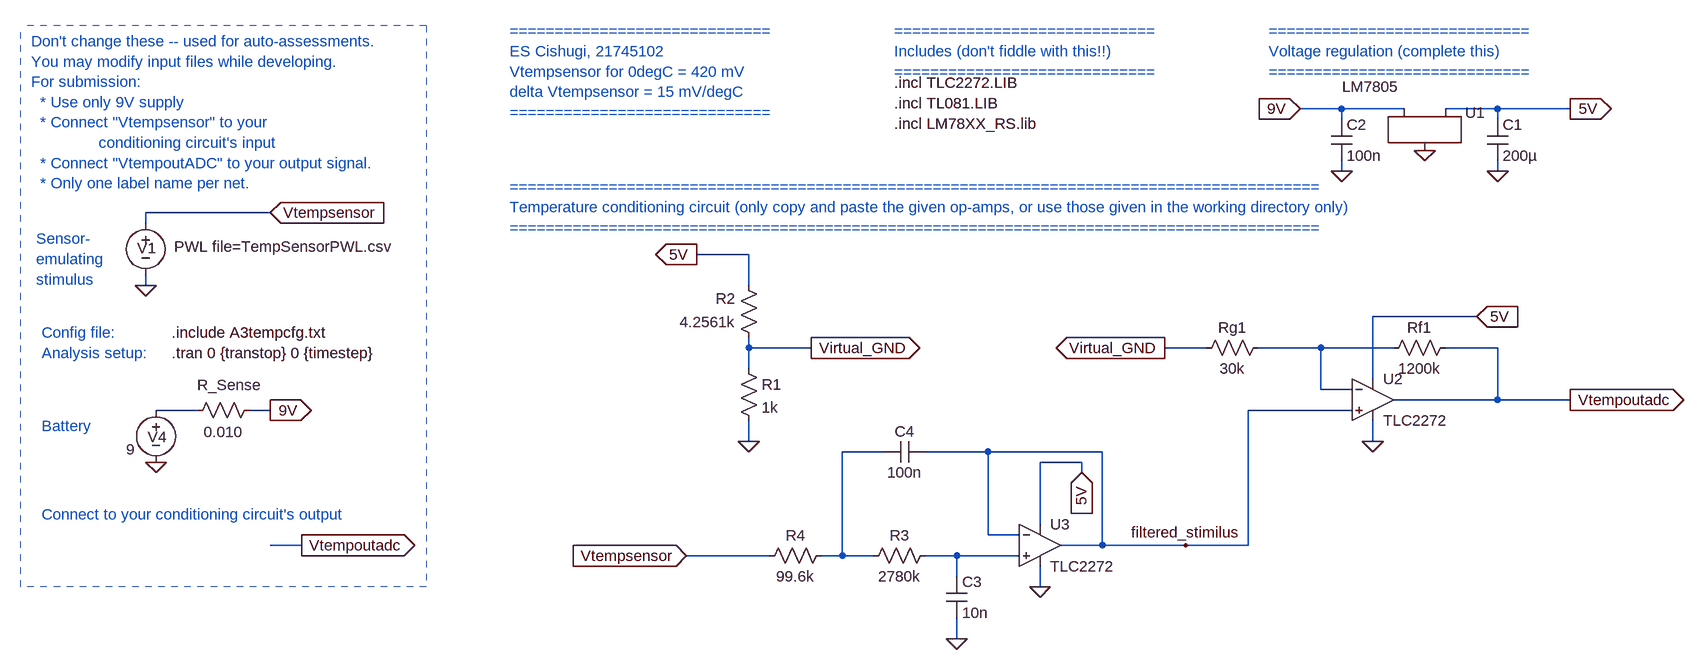
[diagram p0: schematic E344_A3_temp.asc]
E344_A3_temp.asc, the LTspice schematic file:
Version 4
SHEET 1 1824 680
WIRE -272 -1280 -336 -1280
WIRE -176 -1280 -272 -1280
WIRE -32 -1280 -112 -1280
WIRE 80 -1280 -32 -1280
WIRE -272 -1264 -272 -1280
WIRE -32 -1264 -32 -1280
WIRE -272 -1184 -272 -1200
WIRE -32 -1184 -32 -1200
WIRE -1920 -1120 -2112 -1120
WIRE -2112 -1104 -2112 -1120
WIRE -1184 -1056 -1264 -1056
WIRE -2112 -1008 -2112 -1024
WIRE -1184 -1008 -1184 -1056
WIRE -64 -960 -224 -960
WIRE -1184 -912 -1184 -928
WIRE -1088 -912 -1184 -912
WIRE -480 -912 -544 -912
WIRE -304 -912 -400 -912
WIRE -192 -912 -304 -912
WIRE -32 -912 -112 -912
WIRE -1184 -880 -1184 -912
WIRE -224 -864 -224 -960
WIRE -304 -848 -304 -912
WIRE -256 -848 -304 -848
WIRE -32 -832 -32 -912
WIRE -32 -832 -192 -832
WIRE 80 -832 -32 -832
WIRE -2032 -816 -2096 -816
WIRE -1920 -816 -1952 -816
WIRE -256 -816 -416 -816
WIRE -1184 -768 -1184 -800
WIRE -224 -768 -224 -800
WIRE -976 -752 -1040 -752
WIRE -816 -752 -912 -752
WIRE -640 -752 -816 -752
WIRE -672 -736 -736 -736
WIRE -672 -720 -672 -736
WIRE -736 -640 -736 -736
WIRE -816 -624 -816 -752
WIRE -768 -624 -816 -624
WIRE -1872 -608 -1920 -608
WIRE -640 -608 -640 -752
WIRE -640 -608 -704 -608
WIRE -512 -608 -640 -608
WIRE -416 -608 -416 -816
WIRE -416 -608 -512 -608
WIRE -1152 -592 -1280 -592
WIRE -1040 -592 -1040 -752
WIRE -1040 -592 -1072 -592
WIRE -992 -592 -1040 -592
WIRE -864 -592 -912 -592
WIRE -768 -592 -864 -592
WIRE -864 -560 -864 -592
WIRE -736 -544 -736 -576
WIRE -864 -464 -864 -496
FLAG -2112 -1008 0
FLAG -1920 -1120 Vtempsensor
IOPIN -1920 -1120 In
FLAG -1920 -816 9V
IOPIN -1920 -816 Out
FLAG -2096 -736 0
FLAG -336 -1280 9V
IOPIN -336 -1280 In
FLAG -1280 -592 Vtempsensor
IOPIN -1280 -592 In
FLAG -144 -1216 0
FLAG 80 -1280 5V
IOPIN 80 -1280 Out
FLAG 80 -832 Vtempoutadc
IOPIN 80 -832 Out
FLAG -1872 -608 Vtempoutadc
IOPIN -1872 -608 Out
FLAG -32 -1184 0
FLAG -272 -1184 0
FLAG -224 -768 0
FLAG -1184 -768 0
FLAG -64 -960 5V
IOPIN -64 -960 In
FLAG -864 -464 0
FLAG -736 -544 0
FLAG -672 -720 5V
IOPIN -672 -720 In
FLAG -512 -608 filtered_stimilus
FLAG -1264 -1056 5V
IOPIN -1264 -1056 Out
FLAG -1088 -912 Virtual_GND
IOPIN -1088 -912 Out
FLAG -544 -912 Virtual_GND
IOPIN -544 -912 Out
SYMBOL voltage -2112 -1120 R0
WINDOW 123 0 0 Left 0
WINDOW 39 0 0 Left 0
WINDOW 3 44 52 Left 2
WINDOW 0 -13 54 Left 2
SYMATTR Value PWL file=TempSensorPWL.csv
SYMATTR InstName V1
SYMBOL voltage -2096 -832 R0
WINDOW 123 24 44 Left 2
WINDOW 39 0 0 Left 0
WINDOW 3 -46 76 Left 2
WINDOW 0 -13 57 Left 2
SYMATTR Value 9
SYMATTR InstName V4
SYMBOL res -1936 -832 R90
WINDOW 0 -7 47 VBottom 2
WINDOW 3 34 56 VTop 2
SYMATTR InstName R_Sense
SYMATTR Value 0.010
SYMBOL LM7805 -144 -1264 R0
WINDOW 3 -83 -66 Top 2
SYMATTR InstName U1
SYMBOL cap -48 -1264 R0
SYMATTR InstName C1
SYMATTR Value 200µ
SYMBOL cap -288 -1264 R0
SYMATTR InstName C2
SYMATTR Value 100n
SYMBOL Opamps\\opamp2 -224 -896 R0
SYMATTR InstName U2
SYMATTR Value TLC2272
SYMBOL res -96 -928 R90
WINDOW 0 0 56 VBottom 2
WINDOW 3 32 56 VTop 2
SYMATTR InstName Rf1
SYMATTR Value 1200k
SYMBOL res -384 -928 R90
WINDOW 0 0 56 VBottom 2
WINDOW 3 32 56 VTop 2
SYMATTR InstName Rg1
SYMATTR Value 30k
SYMBOL res -1200 -896 R0
SYMATTR InstName R1
SYMATTR Value 1k
SYMBOL res -1168 -912 R180
WINDOW 0 36 76 Left 2
WINDOW 3 36 40 Left 2
SYMATTR InstName R2
SYMATTR Value 4.2561k
SYMBOL Opamps\\opamp2 -736 -672 R0
SYMATTR InstName U3
SYMATTR Value TLC2272
SYMBOL cap -880 -560 R0
SYMATTR InstName C3
SYMATTR Value 10n
SYMBOL res -896 -608 R90
WINDOW 0 0 56 VBottom 2
WINDOW 3 32 56 VTop 2
SYMATTR InstName R3
SYMATTR Value 2780k
SYMBOL res -1056 -608 R90
WINDOW 0 0 56 VBottom 2
WINDOW 3 32 56 VTop 2
SYMATTR InstName R4
SYMATTR Value 99.6k
SYMBOL cap -912 -768 R90
WINDOW 0 0 32 VBottom 2
WINDOW 3 32 32 VTop 2
SYMATTR InstName C4
SYMATTR Value 100n
TEXT -2072 -904 Left 2 !.tran 0 {transtop} 0 {timestep}
TEXT -2072 -936 Left 2 !.include A3tempcfg.txt
TEXT -2288 -1384 Left 2 ;Don't change these -- used for auto-assessments.\nYou may modify input files while developing.\nFor submission: \n  * Use only 9V supply \n  * Connect "Vtempsensor" to your \n               conditioning circuit's input\n  * Connect "VtempoutADC" to your output signal.\n  * Only one label name per net.
TEXT -2272 -936 Left 2 ;Config file:
TEXT -2272 -904 Left 2 ;Analysis setup:
TEXT -2272 -792 Left 2 ;Battery
TEXT -2280 -1080 Left 2 ;Sensor-\nemulating \nstimulus
TEXT -1552 -1400 Left 2 ;=============================\nES Cishugi, 21745102\nVtempsensor for 0degC = 420 mV\ndelta Vtempsensor = 15 mV/degC\n=============================
TEXT -1552 -1160 Left 2 ;==========================================================================================\nTemperature conditioning circuit (only copy and paste the given op-amps, or use those given in the working directory only)\n==========================================================================================
TEXT -384 -1400 Left 2 ;=============================\nVoltage regulation (complete this)\n=============================
TEXT -960 -1320 Left 2 !.incl TLC2272.LIB\n.incl TL081.LIB\n.incl LM78XX_RS.lib
TEXT -2272 -656 Left 2 ;Connect to your conditioning circuit's output
TEXT -960 -1400 Left 2 ;=============================\nIncludes (don't fiddle with this!!)\n=============================
LINE Normal -2304 -544 -2304 -1408 1
LINE Normal -1680 -1408 -1680 -544 1
LINE Normal -1680 -544 -2304 -544 1
LINE Normal -1680 -1408 -2304 -1408 1

The netlist it stands for:
* E344_A3_temp.asc
V1 Vtempsensor 0 PWL file=TempSensorPWL.csv
V4 N002 0 9
R_Sense 9V N002 0.010
XU1 9V 0 5V LM7805
C1 5V 0 200µ
C2 9V 0 100n
XU2 filtered_stimilus N001 5V 0 Vtempoutadc TLC2272  ; pins In+ In- V+ V- OUT
Rf1 Vtempoutadc N001 1200k
Rg1 N001 Virtual_GND 30k
R1 Virtual_GND 0 1k
R2 Virtual_GND 5V 4.2561k
XU3 N004 filtered_stimilus 5V 0 filtered_stimilus TLC2272  ; pins In+ In- V+ V- OUT
C3 N004 0 10n
R3 N004 N003 2780k
R4 N003 Vtempsensor 99.6k
C4 filtered_stimilus N003 100n
.tran 0 {transtop} 0 {timestep}
.include A3tempcfg.txt
* Don't change these -- used for auto-assessments.
* You may modify input files while developing.
* For submission:
*   * Use only 9V supply
*   * Connect "Vtempsensor" to your
*                conditioning circuit's input
*   * Connect "VtempoutADC" to your output signal.
*   * Only one label name per net.
* Config file:
* Analysis setup:
* Battery
* Sensor-
* emulating
* stimulus
* =============================
* ES Cishugi, 21745102
* Vtempsensor for 0degC = 420 mV
* delta Vtempsensor = 15 mV/degC
* =============================
* ==========================================================================================
* Temperature conditioning circuit (only copy and paste the given op-amps, or use those given in the working directory only)
* ==========================================================================================
* =============================
* Voltage regulation (complete this)
* =============================
.incl TLC2272.LIB
.incl TL081.LIB
.incl LM78XX_RS.lib
* Connect to your conditioning circuit's output
* =============================
* Includes (don't fiddle with this!!)
* =============================
.backanno
.end